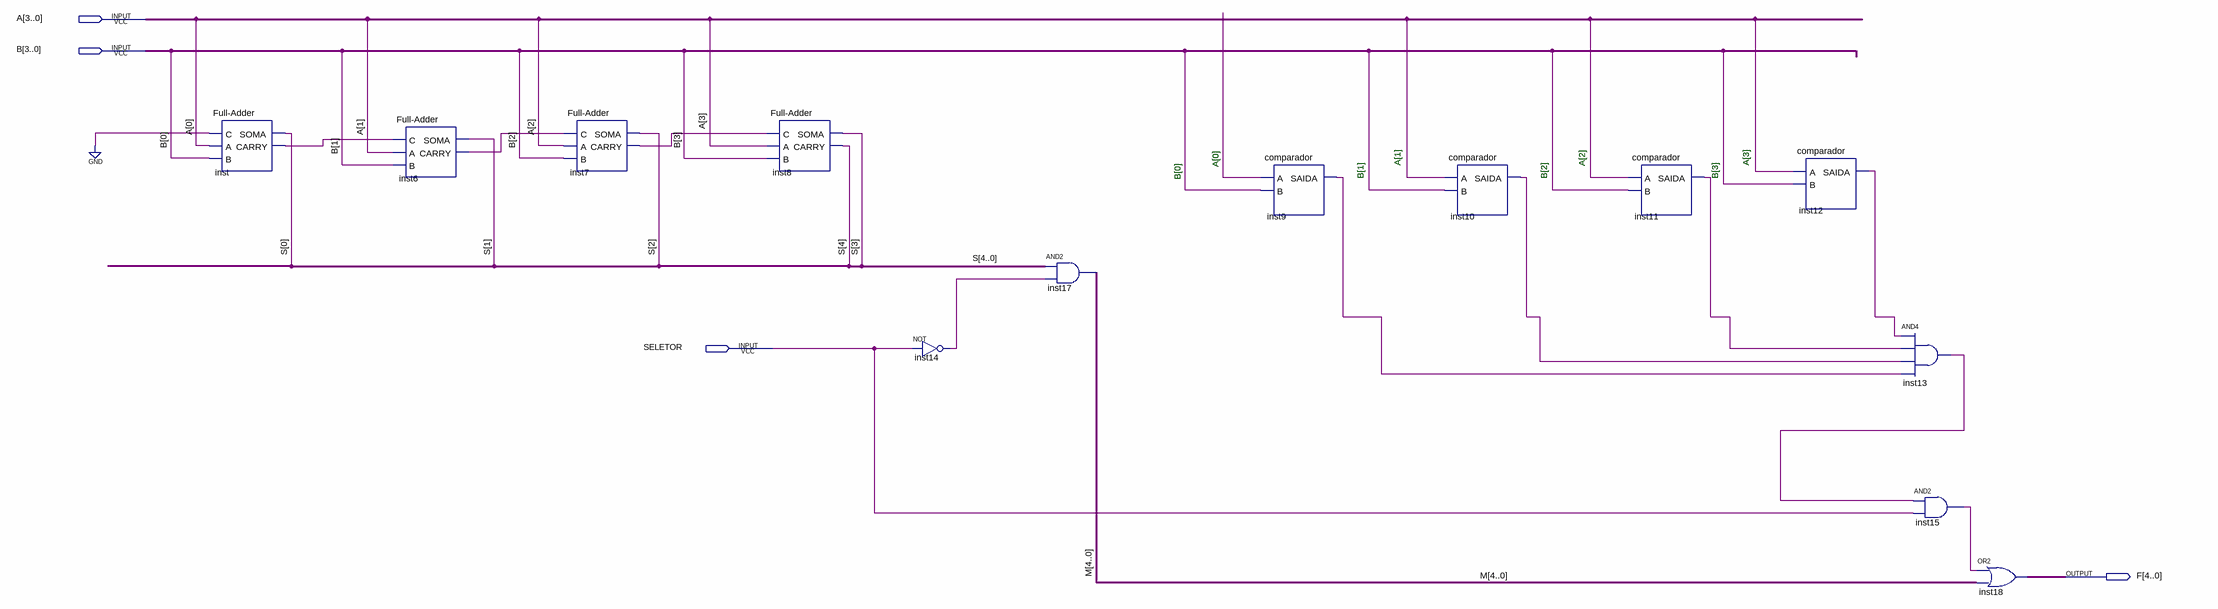
[diagram p0: schematic sheet]
// Quartus schematic somado4bits.bdf as structural Verilog: 13 symbols, 4 pins
module somado4bits (
  input  [3:0] A,
  input  [3:0] B,
  input  SELETOR,
  output [4:0] F
);

  wire inst6_carry, inst7_carry, inst9_saida, inst10_saida, inst11_saida, inst12_saida, inst13_out,
       inst14_out, inst15_out, inst_carry;
  wire [4:0] M, S;

  \Full-Adder  inst (.C(1'b0), .A(A[0]), .B(B[0]), .SOMA(S[0]), .CARRY(inst_carry));
  \Full-Adder  inst6 (.C(inst_carry), .A(A[1]), .B(B[1]), .SOMA(S[1]), .CARRY(inst6_carry));
  \Full-Adder  inst7 (.C(inst6_carry), .A(A[2]), .B(B[2]), .SOMA(S[2]), .CARRY(inst7_carry));
  \Full-Adder  inst8 (.C(inst7_carry), .A(A[3]), .B(B[3]), .SOMA(S[3]), .CARRY(S[4]));
  not inst14 (inst14_out, SELETOR);
  assign M = S & {5{inst14_out}};  // AND2 inst17, 5 bits wide
  comparador inst9 (.A(A[0]), .B(B[0]), .SAIDA(inst9_saida));
  comparador inst10 (.A(A[1]), .B(B[1]), .SAIDA(inst10_saida));
  comparador inst11 (.A(A[2]), .B(B[2]), .SAIDA(inst11_saida));
  comparador inst12 (.A(A[3]), .B(B[3]), .SAIDA(inst12_saida));
  and inst13 (inst13_out, inst12_saida, inst11_saida, inst10_saida, inst9_saida);
  and inst15 (inst15_out, inst13_out, SELETOR);
  assign F = {5{inst15_out}} | M;  // OR2 inst18, 5 bits wide

  // Notes on the sheet:
  //   A[1]
  //   A[3]
  //   A[2]
  //   A[0]
  //   B[1]
  //   B[2]
  //   B[3]
  //   B[0]
endmodule
